# EAGLE schematic oneboard4 (EAGLE 7.5.0)
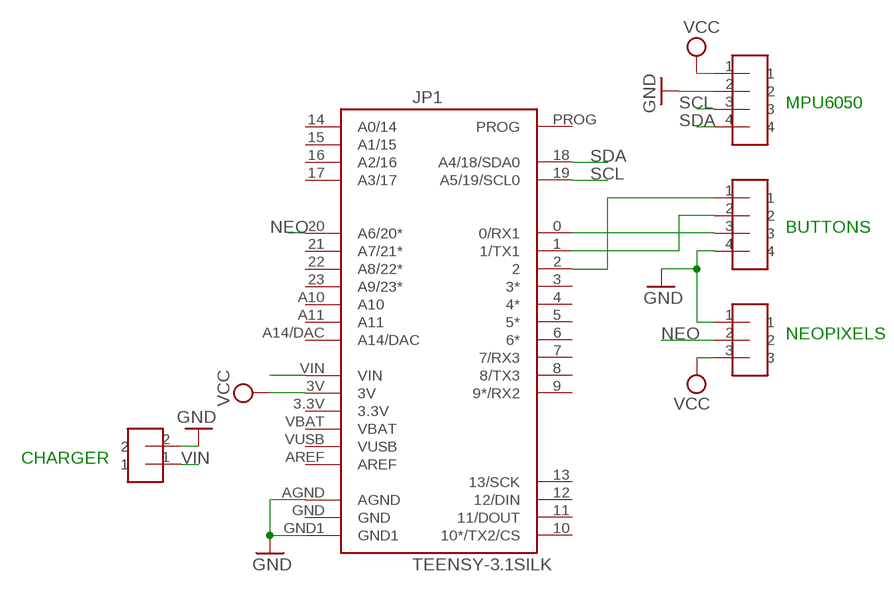
[diagram p0: schematic, sheet 1]

## Parts
JP1  TEENSY-3.1SILK  [TEENSY-3.1]
U$2  HEADER-3  [HEADER-3]
U$3  HEADER-2  [HEADER-2]
U$4  HEADER-4  [HEADER-4]
U$5  HEADER-4  [HEADER-4]

## Nets
GND: JP1.AGND JP1.GND1 U$2.1 U$3.2 U$4.2 U$5.4
N$1: JP1.1(1/TX1) U$5.2
N$2: JP1.0(0/RX1) U$5.3
N$4: JP1.2 U$5.1
NEO: JP1.20(A6/20*) U$2.2
SCL: JP1.19(A5/19/SCL0) U$4.3
SDA: JP1.18(A4/18/SDA0) U$4.4
VCC: JP1.3V U$2.3 U$4.1
VIN: JP1.VIN U$3.1
Unconnected: JP1.3(3*) JP1.3.3V JP1.4(4*) JP1.5(5*) JP1.6(6*) JP1.7(7/RX3) JP1.8(8/TX3) JP1.9(9*/RX2) JP1.10(10*/TX2/CS) JP1.11(11/DOUT) JP1.12(12/DIN) JP1.13(13/SCK) JP1.14(A0/14) JP1.15(A1/15) JP1.16(A2/16) JP1.17(A3/17) JP1.21(A7/21*) JP1.22(A8/22*) JP1.23(A9/23*) JP1.A10 JP1.A11 JP1.A14/DAC JP1.AREF JP1.GND JP1.PROG JP1.VBAT JP1.VUSB

## Notes on the sheet
- MPU6050
- BUTTONS
- NEOPIXELS
- CHARGER

## Library data of the parts
JP1 = SparkFun-Boards:TEENSY-3.1; SF_ID: DEV-12646
U$2 = homemade-hardware:HEADER-3
U$3 = homemade-hardware:HEADER-2
U$4 U$5 = homemade-hardware:HEADER-4